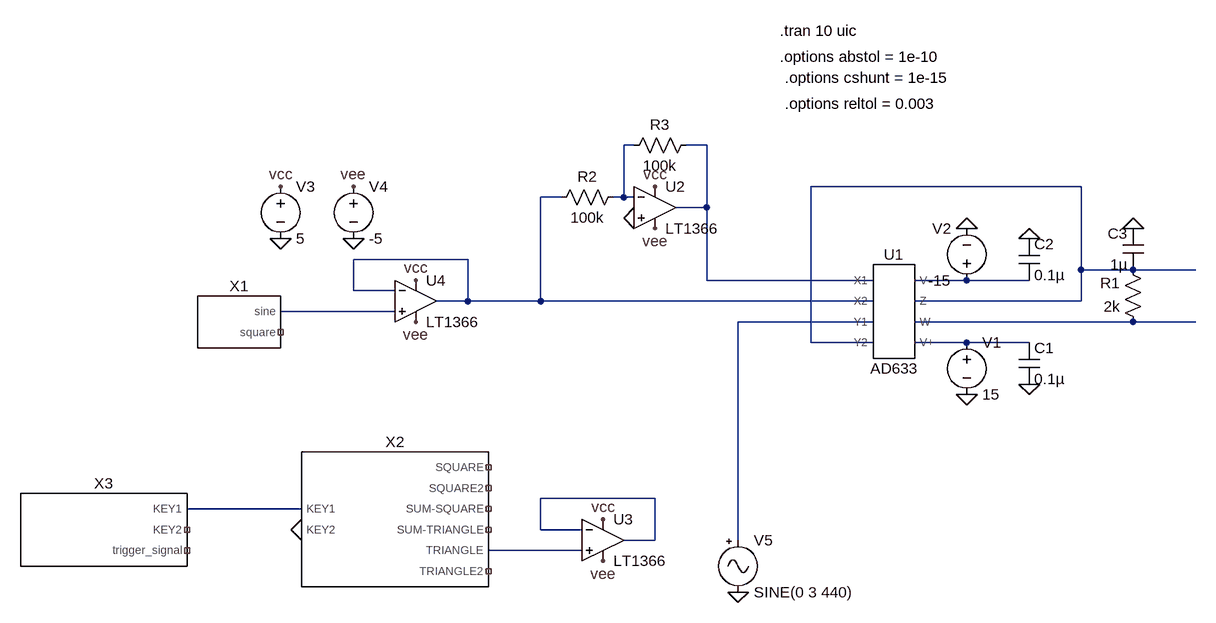
[diagram p0: schematic vcf_hopefully.asc]
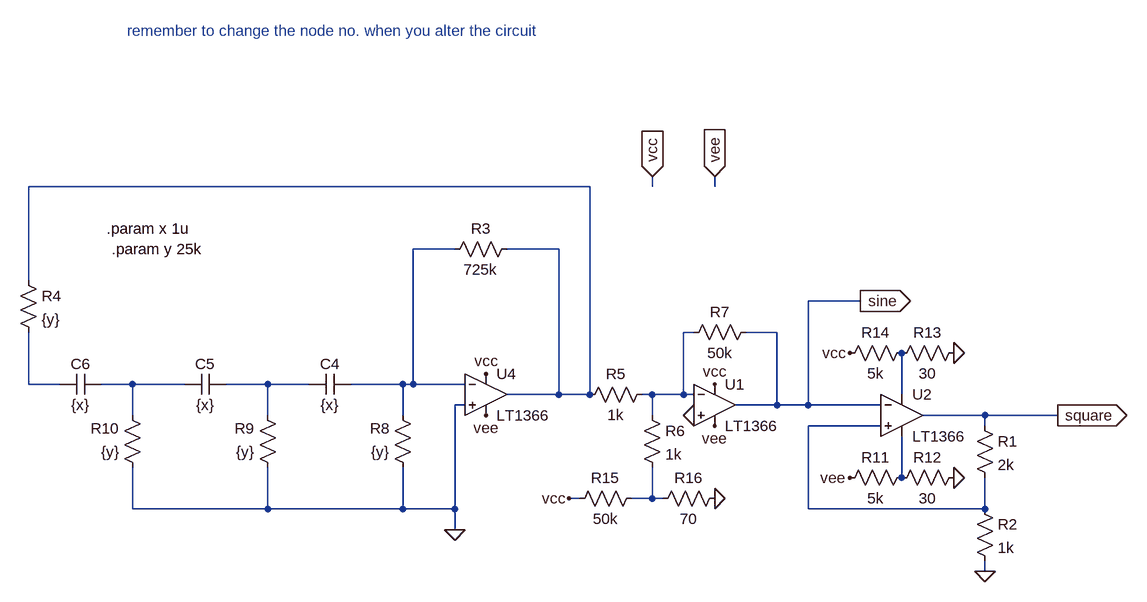
[diagram p1: sub-circuit lfo_new_square.asc]
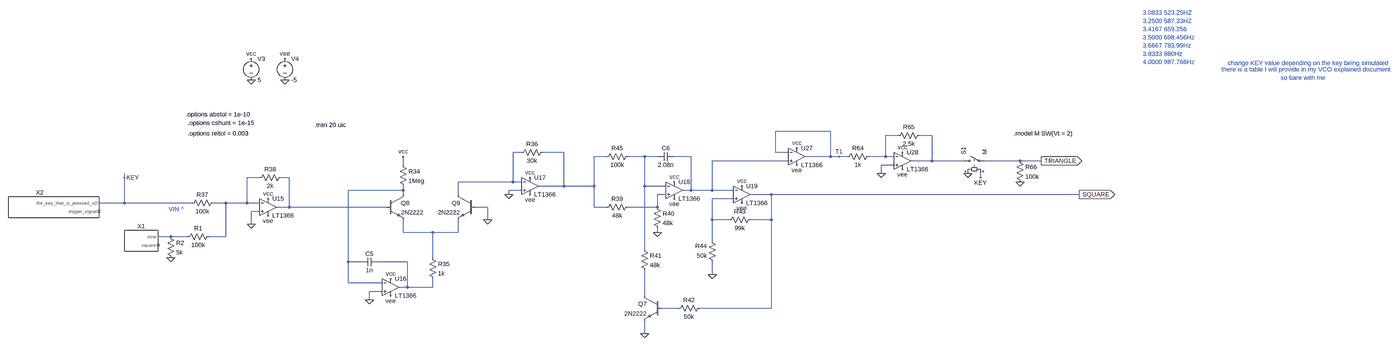
[diagram p2: sub-circuit vco_2keys.asc, whole sheet]
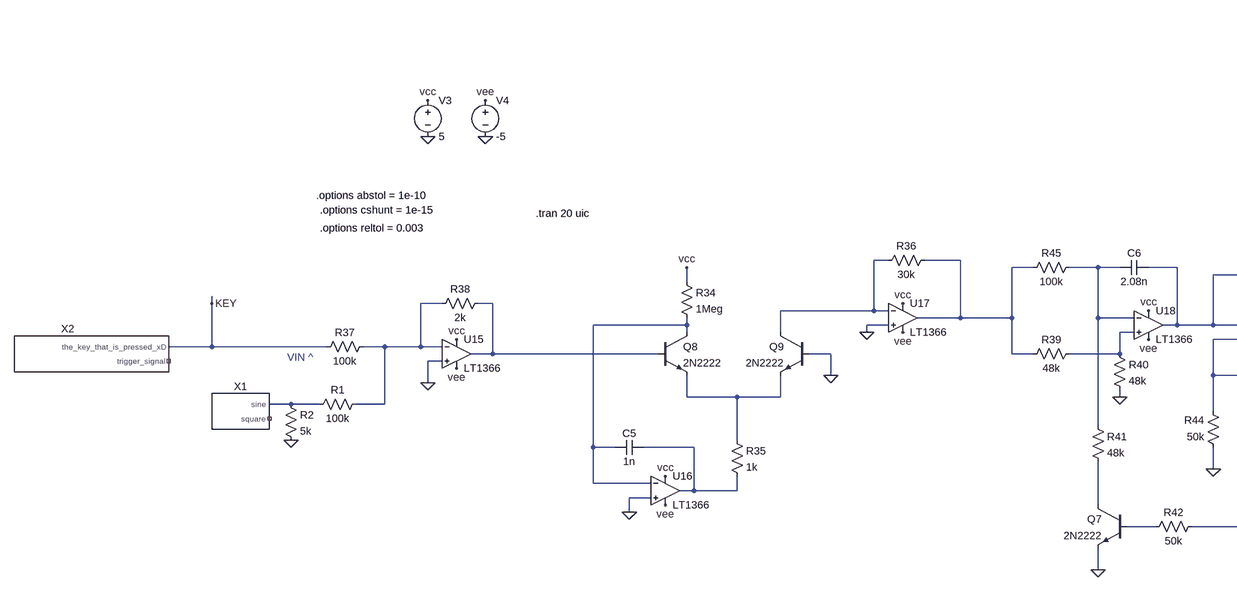
[diagram p3: sub-circuit vco_2keys.asc, part, row 1 of 1, column 1 of 2]
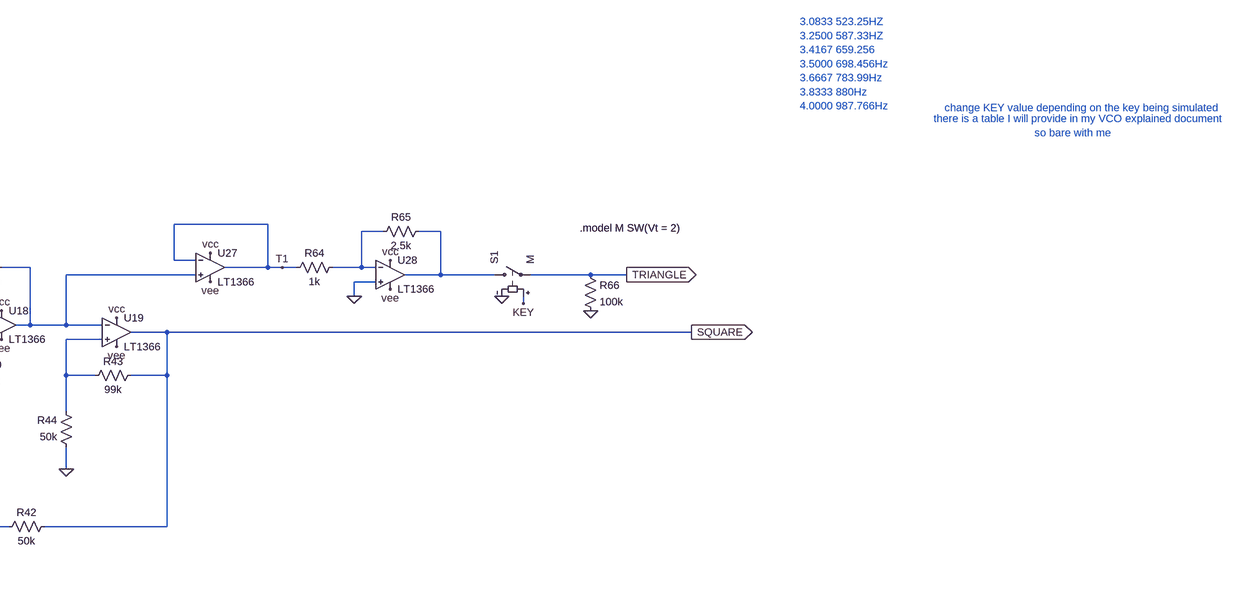
[diagram p4: sub-circuit vco_2keys.asc, part, row 1 of 1, column 2 of 2]
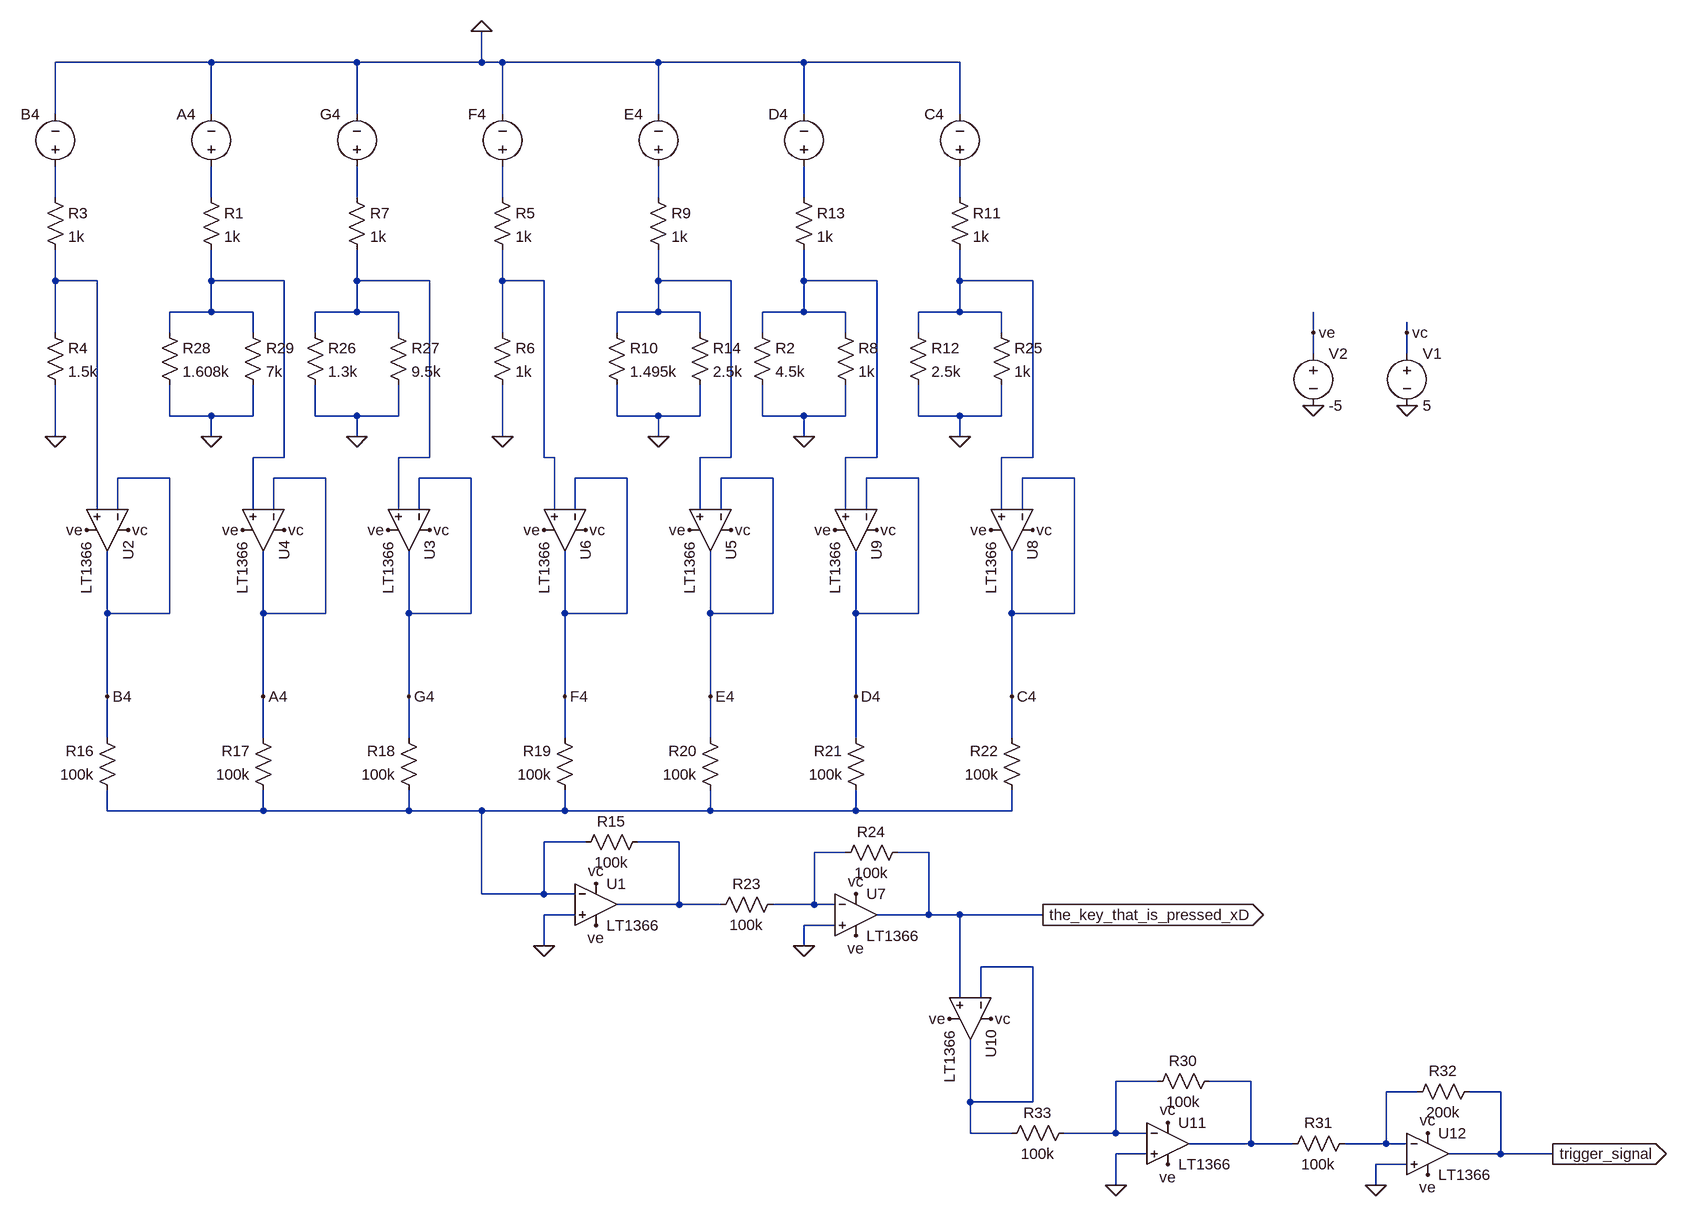
[diagram p5: sub-circuit key_input_with_trigger.asc]
vcf_hopefully.asc, the LTspice schematic file:
Version 4
SHEET 1 880 796
WIRE -112 80 -128 80
WIRE 0 80 -32 80
WIRE 576 144 160 144
WIRE -224 160 -256 160
WIRE -128 160 -128 80
WIRE -128 160 -144 160
WIRE -112 160 -128 160
WIRE 0 176 0 80
WIRE 0 176 -48 176
WIRE -368 256 -544 256
WIRE 576 272 576 144
WIRE 656 272 576 272
WIRE 752 272 656 272
WIRE 0 288 0 176
WIRE 256 288 0 288
WIRE 400 288 320 288
WIRE 496 288 400 288
WIRE -544 304 -544 256
WIRE -480 304 -544 304
WIRE -368 320 -368 256
WIRE -368 320 -416 320
WIRE -256 320 -256 160
WIRE -256 320 -368 320
WIRE 256 320 -256 320
WIRE 576 320 576 272
WIRE 576 320 320 320
WIRE -480 336 -656 336
WIRE 256 352 48 352
WIRE 656 352 320 352
WIRE 752 352 656 352
WIRE 160 384 160 144
WIRE 256 384 160 384
WIRE 400 384 320 384
WIRE 496 384 400 384
WIRE -80 624 -256 624
WIRE -624 640 -800 640
WIRE -256 672 -256 624
WIRE -192 672 -256 672
WIRE -80 688 -80 624
WIRE -80 688 -128 688
WIRE 48 688 48 352
WIRE -192 704 -336 704
FLAG 400 208 0
FLAG 400 464 0
FLAG 496 224 0
FLAG 496 448 0
FLAG 656 208 0
FLAG -544 224 0
FLAG -656 224 0
FLAG -656 144 vcc
FLAG -544 144 vee
FLAG -80 144 vcc
FLAG -80 208 vee
FLAG -112 192 0
FLAG -160 656 vcc
FLAG -160 720 vee
FLAG -448 288 vcc
FLAG -448 352 vee
FLAG -624 672 0
FLAG 48 768 0
SYMBOL AutoGenerated/AD633 288 336 R0
SYMATTR InstName U1
SYMBOL voltage 400 368 R0
SYMATTR InstName V1
SYMATTR Value 15
SYMBOL voltage 400 304 R180
WINDOW 0 24 96 Left 2
WINDOW 3 24 16 Left 2
SYMATTR InstName V2
SYMATTR Value -15
SYMBOL cap 480 384 R0
SYMATTR InstName C1
SYMATTR Value 0.1µ
SYMBOL cap 480 224 R0
SYMATTR InstName C2
SYMATTR Value 0.1µ
SYMBOL res 672 368 R180
WINDOW 0 36 76 Left 2
WINDOW 3 36 40 Left 2
SYMATTR InstName R1
SYMATTR Value 2k
SYMBOL cap 672 272 R180
WINDOW 0 24 56 Left 2
WINDOW 3 24 8 Left 2
SYMATTR InstName C3
SYMATTR Value 1µ
SYMBOL lfo_new_square -720 352 R0
SYMATTR InstName X1
SYMBOL Key_Input_2VCOSFINAL -928 672 R0
SYMATTR InstName X3
SYMBOL Opamps/LT1366 -80 112 R0
SYMATTR InstName U2
SYMBOL voltage -656 128 R0
SYMATTR InstName V3
SYMATTR Value 5
SYMBOL voltage -544 128 R0
SYMATTR InstName V4
SYMATTR Value -5
SYMBOL res -128 144 R90
WINDOW 0 0 56 VBottom 2
WINDOW 3 32 56 VTop 2
SYMATTR InstName R2
SYMATTR Value 100k
SYMBOL res -16 64 R90
WINDOW 0 0 56 VBottom 2
WINDOW 3 32 56 VTop 2
SYMATTR InstName R3
SYMATTR Value 100k
SYMBOL Opamps/LT1366 -160 624 R0
SYMATTR InstName U3
SYMBOL vco_2keys -480 656 R0
SYMATTR InstName X2
SYMBOL Opamps/LT1366 -448 256 R0
SYMATTR InstName U4
SYMBOL Misc/signal 48 672 R0
SYMATTR InstName V5
SYMATTR Value SINE(0 3 440)
TEXT 112 -96 Left 2 !.tran 10 uic
TEXT 112 -56 Left 2 !.options abstol = 1e-10
TEXT 120 -24 Left 2 !.options cshunt = 1e-15
TEXT 120 16 Left 2 !.options reltol = 0.003

lfo_new_square.asc, the sub-circuit schematic file:
Version 4
SHEET 1 1144 880
WIRE -576 -144 -1440 -144
WIRE -480 -144 -480 -160
WIRE -384 -144 -384 -160
WIRE -784 -48 -848 -48
WIRE -624 -48 -704 -48
WIRE -1440 0 -1440 -144
WIRE -160 32 -240 32
WIRE -416 80 -432 80
WIRE -288 80 -336 80
WIRE -1440 160 -1440 80
WIRE -1392 160 -1440 160
WIRE -1280 160 -1328 160
WIRE -1200 160 -1280 160
WIRE -1072 160 -1136 160
WIRE -1008 160 -1072 160
WIRE -864 160 -944 160
WIRE -848 160 -848 -48
WIRE -848 160 -864 160
WIRE -768 160 -848 160
WIRE -624 176 -624 -48
WIRE -624 176 -704 176
WIRE -576 176 -576 -144
WIRE -576 176 -624 176
WIRE -480 176 -496 176
WIRE -432 176 -432 80
WIRE -432 176 -480 176
WIRE -416 176 -432 176
WIRE -96 176 -96 112
WIRE -768 192 -784 192
WIRE -288 192 -288 80
WIRE -288 192 -352 192
WIRE -240 192 -240 32
WIRE -240 192 -288 192
WIRE -128 192 -240 192
WIRE -1280 208 -1280 160
WIRE -1072 208 -1072 160
WIRE -864 208 -864 160
WIRE -480 208 -480 176
WIRE 32 208 -64 208
WIRE 144 208 32 208
WIRE -128 224 -240 224
WIRE 32 224 32 208
WIRE -96 304 -96 240
WIRE -592 336 -608 336
WIRE -480 336 -480 288
WIRE -480 336 -512 336
WIRE -464 336 -480 336
WIRE -1280 352 -1280 288
WIRE -1072 352 -1072 288
WIRE -1072 352 -1280 352
WIRE -864 352 -864 288
WIRE -864 352 -1072 352
WIRE -784 352 -784 192
WIRE -784 352 -864 352
WIRE -240 352 -240 224
WIRE 32 352 32 304
WIRE 32 352 -240 352
WIRE -784 384 -784 352
WIRE 32 448 32 432
FLAG 32 448 0
FLAG -784 384 0
FLAG -480 -160 vcc
IOPIN -480 -160 In
FLAG -384 -160 vee
IOPIN -384 -160 In
FLAG -736 144 vcc
FLAG -736 208 vee
FLAG 144 208 square
IOPIN 144 208 Out
FLAG -160 32 sine
IOPIN -160 32 Out
FLAG -416 208 0
FLAG -384 160 vcc
FLAG -384 224 vee
FLAG -16 112 0
FLAG -16 304 0
FLAG -176 112 vcc
FLAG -176 304 vee
FLAG -384 336 0
FLAG -608 336 vcc
SYMBOL res 16 208 R0
SYMATTR InstName R1
SYMATTR Value 2k
SYMBOL res 16 336 R0
SYMATTR InstName R2
SYMATTR Value 1k
SYMBOL cap -944 144 R90
WINDOW 0 0 32 VBottom 2
WINDOW 3 32 32 VTop 2
SYMATTR InstName C4
SYMATTR Value {x}
SYMBOL cap -1136 144 R90
WINDOW 0 0 32 VBottom 2
WINDOW 3 32 32 VTop 2
SYMATTR InstName C5
SYMATTR Value {x}
SYMBOL cap -1328 144 R90
WINDOW 0 0 32 VBottom 2
WINDOW 3 32 32 VTop 2
SYMATTR InstName C6
SYMATTR Value {x}
SYMBOL res -848 304 R180
WINDOW 0 36 76 Left 2
WINDOW 3 36 40 Left 2
SYMATTR InstName R8
SYMATTR Value {y}
SYMBOL res -1056 304 R180
WINDOW 0 36 76 Left 2
WINDOW 3 36 40 Left 2
SYMATTR InstName R9
SYMATTR Value {y}
SYMBOL res -1264 304 R180
WINDOW 0 36 76 Left 2
WINDOW 3 36 40 Left 2
SYMATTR InstName R10
SYMATTR Value {y}
SYMBOL Opamps/LT1366 -736 112 R0
SYMATTR InstName U4
SYMBOL Opamps/LT1366 -96 144 R0
SYMATTR InstName U2
SYMBOL res -688 -64 R90
WINDOW 0 0 56 VBottom 2
WINDOW 3 32 56 VTop 2
SYMATTR InstName R3
SYMATTR Value 725k
SYMBOL Opamps/LT1366 -384 128 R0
SYMATTR InstName U1
SYMBOL res -480 160 R90
WINDOW 0 0 56 VBottom 2
WINDOW 3 32 56 VTop 2
SYMATTR InstName R5
SYMATTR Value 1k
SYMBOL res -496 192 R0
SYMATTR InstName R6
SYMATTR Value 1k
SYMBOL res -320 64 R90
WINDOW 0 0 56 VBottom 2
WINDOW 3 32 56 VTop 2
SYMATTR InstName R7
SYMATTR Value 50k
SYMBOL res -80 288 R90
WINDOW 0 0 56 VBottom 2
WINDOW 3 32 56 VTop 2
SYMATTR InstName R11
SYMATTR Value 5k
SYMBOL res 0 288 R90
WINDOW 0 0 56 VBottom 2
WINDOW 3 32 56 VTop 2
SYMATTR InstName R12
SYMATTR Value 30
SYMBOL res 0 96 R90
WINDOW 0 0 56 VBottom 2
WINDOW 3 32 56 VTop 2
SYMATTR InstName R13
SYMATTR Value 30
SYMBOL res -80 96 R90
WINDOW 0 0 56 VBottom 2
WINDOW 3 32 56 VTop 2
SYMATTR InstName R14
SYMATTR Value 5k
SYMBOL res -1456 -16 R0
SYMATTR InstName R4
SYMATTR Value {y}
SYMBOL res -608 352 R270
WINDOW 0 32 56 VTop 2
WINDOW 3 0 56 VBottom 2
SYMATTR InstName R15
SYMATTR Value 50k
SYMBOL res -480 352 R270
WINDOW 0 32 56 VTop 2
WINDOW 3 0 56 VBottom 2
SYMATTR InstName R16
SYMATTR Value 70
TEXT -1320 -80 Left 2 !.param x 1u
TEXT -1312 -48 Left 2 !.param y 25k
TEXT -1288 -384 Left 2 ;remember to change the node no. when you alter the circuit

vco_2keys.asc, the sub-circuit schematic file:
Version 4
SHEET 1 3312 3404
WIRE 512 1840 304 1840
WIRE 768 1856 720 1856
WIRE 896 1856 848 1856
WIRE -800 1920 -832 1920
WIRE -640 1920 -720 1920
WIRE 304 1920 304 1840
WIRE 352 1920 304 1920
WIRE -336 1936 -384 1936
WIRE -192 1936 -256 1936
WIRE -144 1936 -192 1936
WIRE -16 1936 -80 1936
WIRE 512 1936 512 1840
WIRE 512 1936 416 1936
WIRE 544 1936 512 1936
WIRE 576 1936 544 1936
WIRE 720 1936 720 1856
WIRE 720 1936 656 1936
WIRE 752 1936 720 1936
WIRE 352 1952 64 1952
WIRE 896 1952 896 1856
WIRE 896 1952 816 1952
WIRE 1056 1952 896 1952
WIRE 1296 1952 1136 1952
WIRE 1376 1952 1296 1952
WIRE -1248 1968 -1248 1936
WIRE 752 1968 704 1968
WIRE 704 2000 704 1968
WIRE -2304 2016 -2304 2000
WIRE -1792 2016 -1840 2016
WIRE -1680 2016 -1712 2016
WIRE 1120 2016 1120 2000
WIRE -832 2032 -832 1920
WIRE -832 2032 -1040 2032
WIRE -800 2032 -832 2032
WIRE -640 2048 -640 1920
WIRE -640 2048 -736 2048
WIRE -384 2048 -384 1936
WIRE -384 2048 -640 2048
WIRE -192 2048 -192 1936
WIRE -112 2048 -192 2048
WIRE -1248 2064 -1248 2048
WIRE -1248 2064 -1456 2064
WIRE -800 2064 -848 2064
WIRE -16 2064 -16 1936
WIRE -16 2064 -48 2064
WIRE 64 2064 64 1952
WIRE 64 2064 -16 2064
WIRE 144 2064 64 2064
WIRE -1248 2080 -1248 2064
WIRE -1040 2080 -1040 2032
WIRE -848 2080 -848 2064
WIRE -112 2080 -144 2080
WIRE 288 2080 208 2080
WIRE 1520 2080 288 2080
WIRE 144 2096 64 2096
WIRE -2304 2112 -2304 2016
WIRE -2304 2112 -2400 2112
WIRE -2048 2112 -2304 2112
WIRE -1920 2112 -1968 2112
WIRE -1840 2112 -1840 2016
WIRE -1840 2112 -1920 2112
WIRE -1792 2112 -1840 2112
WIRE -1680 2128 -1680 2016
WIRE -1680 2128 -1728 2128
WIRE -1312 2128 -1680 2128
WIRE -928 2128 -976 2128
WIRE -384 2128 -384 2048
WIRE -336 2128 -384 2128
WIRE -144 2128 -144 2080
WIRE -144 2128 -256 2128
WIRE -1792 2144 -1824 2144
WIRE -928 2176 -928 2128
WIRE 64 2176 64 2096
WIRE 128 2176 64 2176
WIRE 288 2176 288 2080
WIRE 288 2176 208 2176
WIRE -1824 2192 -1824 2144
WIRE -1248 2224 -1248 2176
WIRE -1136 2224 -1248 2224
WIRE -1040 2224 -1040 2176
WIRE -1040 2224 -1136 2224
WIRE -144 2224 -144 2208
WIRE -2128 2240 -2176 2240
WIRE -2064 2240 -2128 2240
WIRE -1920 2240 -1920 2112
WIRE -1920 2240 -1984 2240
WIRE 64 2256 64 2176
WIRE -192 2288 -192 2048
WIRE -1136 2320 -1136 2224
WIRE -1456 2336 -1456 2064
WIRE -1408 2336 -1456 2336
WIRE -1232 2336 -1344 2336
WIRE 64 2384 64 2336
WIRE -1456 2416 -1456 2336
WIRE -1328 2416 -1456 2416
WIRE -1232 2432 -1232 2336
WIRE -1232 2432 -1264 2432
WIRE -1136 2432 -1136 2400
WIRE -1136 2432 -1232 2432
WIRE -1328 2448 -1376 2448
WIRE -192 2464 -192 2368
WIRE -1376 2480 -1376 2448
WIRE -64 2512 -128 2512
WIRE 288 2512 288 2176
WIRE 288 2512 16 2512
WIRE -192 2608 -192 2560
FLAG -928 2176 0
FLAG -1248 1936 vcc
FLAG -1376 2480 0
FLAG -848 2080 0
FLAG -768 2016 vcc
FLAG -768 2080 vee
FLAG -1296 2400 vcc
FLAG -1296 2464 vee
FLAG -1760 2096 vcc
FLAG -1824 2192 0
FLAG -80 2032 vcc
FLAG 176 2048 vcc
FLAG 1376 1952 TRIANGLE
IOPIN 1376 1952 Out
FLAG -144 2224 0
FLAG -192 2608 0
FLAG 64 2384 0
FLAG 176 2112 vee
FLAG -80 2096 vee
FLAG -1760 2160 vee
FLAG 1520 2080 SQUARE
IOPIN 1520 2080 Out
FLAG 384 1904 vcc
FLAG 384 1968 vee
FLAG 704 2000 0
FLAG 784 1920 vcc
FLAG 784 1984 vee
FLAG 1296 2032 0
FLAG 544 1936 T1
FLAG -1696 1568 0
FLAG -1824 1568 0
FLAG -1824 1488 vcc
FLAG -1696 1488 vee
FLAG 1072 2000 0
FLAG -2304 2016 KEY
FLAG 1120 2016 KEY
FLAG -2128 2320 0
SYMBOL res -1264 1952 R0
SYMATTR InstName R34
SYMATTR Value 1Meg
SYMBOL cap -1344 2320 R90
WINDOW 0 0 32 VBottom 2
WINDOW 3 32 32 VTop 2
SYMATTR InstName C5
SYMATTR Value 1n
SYMBOL res -1152 2304 R0
SYMATTR InstName R35
SYMATTR Value 1k
SYMBOL res -704 1904 R90
WINDOW 0 0 56 VBottom 2
WINDOW 3 32 56 VTop 2
SYMATTR InstName R36
SYMATTR Value 30k
SYMBOL res -1952 2096 R90
WINDOW 0 0 56 VBottom 2
WINDOW 3 32 56 VTop 2
SYMATTR InstName R37
SYMATTR Value 100k
SYMBOL res -1696 2000 R90
WINDOW 0 0 56 VBottom 2
WINDOW 3 32 56 VTop 2
SYMATTR InstName R38
SYMATTR Value 2k
SYMBOL cap -80 1920 R90
WINDOW 0 0 32 VBottom 2
WINDOW 3 32 32 VTop 2
SYMATTR InstName C6
SYMATTR Value 2.08n
SYMBOL res -240 2112 R90
WINDOW 0 0 56 VBottom 2
WINDOW 3 32 56 VTop 2
SYMATTR InstName R39
SYMATTR Value 48k
SYMBOL res -160 2112 R0
SYMATTR InstName R40
SYMATTR Value 48k
SYMBOL res -208 2272 R0
SYMATTR InstName R41
SYMATTR Value 48k
SYMBOL npn -128 2464 M0
SYMATTR InstName Q7
SYMATTR Value 2N2222
SYMBOL res 32 2496 R90
WINDOW 0 0 56 VBottom 2
WINDOW 3 32 56 VTop 2
SYMATTR InstName R42
SYMATTR Value 50k
SYMBOL res 224 2160 R90
WINDOW 0 0 56 VBottom 2
WINDOW 3 32 56 VTop 2
SYMATTR InstName R43
SYMATTR Value 99k
SYMBOL res 80 2352 R180
WINDOW 0 36 76 Left 2
WINDOW 3 36 40 Left 2
SYMATTR InstName R44
SYMATTR Value 50k
SYMBOL res -240 1920 R90
WINDOW 0 0 56 VBottom 2
WINDOW 3 32 56 VTop 2
SYMATTR InstName R45
SYMATTR Value 100k
SYMBOL npn -1312 2080 R0
SYMATTR InstName Q8
SYMATTR Value 2N2222
SYMBOL npn -976 2080 M0
SYMATTR InstName Q9
SYMATTR Value 2N2222
SYMBOL LT1366 -1760 2064 R0
SYMATTR InstName U15
SYMBOL LT1366 -1296 2368 R0
SYMATTR InstName U16
SYMBOL LT1366 -768 1984 R0
SYMATTR InstName U17
SYMBOL LT1366 -80 2000 R0
SYMATTR InstName U18
SYMBOL LT1366 176 2016 R0
SYMATTR InstName U19
SYMBOL LT1366 384 1872 R0
SYMATTR InstName U27
SYMBOL LT1366 784 1888 R0
SYMATTR InstName U28
SYMBOL res 672 1920 R90
WINDOW 0 0 56 VBottom 2
WINDOW 3 32 56 VTop 2
SYMATTR InstName R64
SYMATTR Value 1k
SYMBOL res 864 1840 R90
WINDOW 0 0 56 VBottom 2
WINDOW 3 32 56 VTop 2
SYMATTR InstName R65
SYMATTR Value 2.5k
SYMBOL res 1280 1936 R0
SYMATTR InstName R66
SYMATTR Value 100k
SYMBOL voltage -1824 1472 R0
SYMATTR InstName V3
SYMATTR Value 5
SYMBOL voltage -1696 1472 R0
SYMATTR InstName V4
SYMATTR Value -5
SYMBOL lfo_new_square -2240 2256 R0
SYMATTR InstName X1
SYMBOL Key_Input_with_trigger -2624 2128 R0
SYMATTR InstName X2
SYMBOL res -1968 2224 R90
WINDOW 0 0 56 VBottom 2
WINDOW 3 32 56 VTop 2
SYMATTR InstName R1
SYMATTR Value 100k
SYMBOL sw 1040 1952 R270
SYMATTR InstName S1
SYMATTR Value M
SYMBOL res -2144 2224 R0
SYMATTR InstName R2
SYMATTR Value 5k
TEXT -2136 2136 Left 2 ;VIN ^
TEXT 2696 1504 Left 2 ;change KEY value depending on the key being simulated
TEXT 2672 1528 Left 2 ;there is a table I will provide in my VCO explained document
TEXT 2896 1560 Left 2 ;so bare with me
TEXT 2328 1312 Left 2 ;3.0833 523.25HZ
TEXT 2328 1344 Left 2 ;3.2500 587.33HZ\n3.4167 659.256\n3.5000 698.456Hz\n3.6667 783.99Hz\n3.8333 880Hz\n4.0000 987.766Hz
TEXT 1272 1848 Left 2 !.model M SW(Vt = 2)
TEXT -1584 1816 Left 2 !.tran 20 uic
TEXT -2072 1776 Left 2 !.options abstol = 1e-10
TEXT -2064 1808 Left 2 !.options cshunt = 1e-15
TEXT -2064 1848 Left 2 !.options reltol = 0.003

key_input_with_trigger.asc, the sub-circuit schematic file:
Version 4
SHEET 1 1488 1832
WIRE -800 48 -1040 48
WIRE -576 48 -800 48
WIRE -384 48 -384 0
WIRE -384 48 -576 48
WIRE -352 48 -384 48
WIRE -112 48 -352 48
WIRE 112 48 -112 48
WIRE 352 48 112 48
WIRE -1040 128 -1040 48
WIRE -800 128 -800 48
WIRE -576 128 -576 48
WIRE -352 128 -352 48
WIRE -112 128 -112 48
WIRE 112 128 112 48
WIRE 352 128 352 48
WIRE -1040 256 -1040 208
WIRE -800 256 -800 208
WIRE -576 256 -576 208
WIRE -352 256 -352 208
WIRE -112 256 -112 208
WIRE 112 256 112 208
WIRE 352 256 352 208
WIRE -1040 384 -1040 336
WIRE -976 384 -1040 384
WIRE -800 384 -800 336
WIRE -688 384 -800 384
WIRE -576 384 -576 336
WIRE -464 384 -576 384
WIRE -352 384 -352 336
WIRE -288 384 -352 384
WIRE -112 384 -112 336
WIRE 0 384 -112 384
WIRE 112 384 112 336
WIRE 224 384 112 384
WIRE 352 384 352 336
WIRE 464 384 352 384
WIRE -800 432 -800 384
WIRE -800 432 -864 432
WIRE -736 432 -800 432
WIRE -576 432 -576 384
WIRE -576 432 -640 432
WIRE -512 432 -576 432
WIRE -112 432 -112 384
WIRE -112 432 -176 432
WIRE -48 432 -112 432
WIRE 112 432 112 384
WIRE 112 432 48 432
WIRE 176 432 112 432
WIRE 352 432 352 384
WIRE 352 432 288 432
WIRE 416 432 352 432
WIRE -1040 464 -1040 384
WIRE -864 464 -864 432
WIRE -736 464 -736 432
WIRE -640 464 -640 432
WIRE -512 464 -512 432
WIRE -352 464 -352 384
WIRE -176 464 -176 432
WIRE -48 464 -48 432
WIRE 48 464 48 432
WIRE 176 464 176 432
WIRE 288 464 288 432
WIRE 416 464 416 432
WIRE 896 464 896 432
WIRE 1040 464 1040 448
WIRE 896 496 896 464
WIRE 1040 496 1040 464
WIRE -864 592 -864 544
WIRE -800 592 -864 592
WIRE -736 592 -736 544
WIRE -736 592 -800 592
WIRE -640 592 -640 544
WIRE -576 592 -640 592
WIRE -512 592 -512 544
WIRE -512 592 -576 592
WIRE -176 592 -176 544
WIRE -112 592 -176 592
WIRE -48 592 -48 544
WIRE -48 592 -112 592
WIRE 48 592 48 544
WIRE 112 592 48 592
WIRE 176 592 176 544
WIRE 176 592 112 592
WIRE 288 592 288 544
WIRE 352 592 288 592
WIRE 416 592 416 544
WIRE 416 592 352 592
WIRE -1040 624 -1040 544
WIRE -800 624 -800 592
WIRE -576 624 -576 592
WIRE -352 624 -352 544
WIRE -112 624 -112 592
WIRE 112 624 112 592
WIRE 352 624 352 592
WIRE -688 656 -688 384
WIRE -688 656 -736 656
WIRE -464 656 -464 384
WIRE -464 656 -512 656
WIRE -288 656 -288 384
WIRE -272 656 -288 656
WIRE 0 656 0 384
WIRE 0 656 -48 656
WIRE 224 656 224 384
WIRE 224 656 176 656
WIRE 464 656 464 384
WIRE 464 656 416 656
WIRE -864 688 -944 688
WIRE -624 688 -704 688
WIRE -400 688 -480 688
WIRE -160 688 -240 688
WIRE 64 688 -16 688
WIRE 288 688 208 688
WIRE 528 688 448 688
WIRE -976 736 -976 384
WIRE -944 736 -944 688
WIRE -736 736 -736 656
WIRE -704 736 -704 688
WIRE -512 736 -512 656
WIRE -480 736 -480 688
WIRE -272 736 -272 656
WIRE -240 736 -240 688
WIRE -48 736 -48 656
WIRE -16 736 -16 688
WIRE 176 736 176 656
WIRE 208 736 208 688
WIRE 416 736 416 656
WIRE 448 736 448 688
WIRE -960 896 -960 800
WIRE -864 896 -864 688
WIRE -864 896 -960 896
WIRE -720 896 -720 800
WIRE -624 896 -624 688
WIRE -624 896 -720 896
WIRE -496 896 -496 800
WIRE -400 896 -400 688
WIRE -400 896 -496 896
WIRE -256 896 -256 800
WIRE -160 896 -160 688
WIRE -160 896 -256 896
WIRE -32 896 -32 800
WIRE 64 896 64 688
WIRE 64 896 -32 896
WIRE 192 896 192 800
WIRE 288 896 288 688
WIRE 288 896 192 896
WIRE 432 896 432 800
WIRE 528 896 528 688
WIRE 528 896 432 896
WIRE -960 1024 -960 896
WIRE -720 1024 -720 896
WIRE -496 1024 -496 896
WIRE -256 1024 -256 896
WIRE -32 1024 -32 896
WIRE 192 1024 192 896
WIRE 432 1024 432 896
WIRE -960 1088 -960 1024
WIRE -720 1088 -720 1024
WIRE -496 1088 -496 1024
WIRE -256 1088 -256 1024
WIRE -32 1088 -32 1024
WIRE 192 1088 192 1024
WIRE 432 1088 432 1024
WIRE -960 1200 -960 1168
WIRE -720 1200 -720 1168
WIRE -720 1200 -960 1200
WIRE -496 1200 -496 1168
WIRE -496 1200 -720 1200
WIRE -384 1200 -496 1200
WIRE -256 1200 -256 1168
WIRE -256 1200 -384 1200
WIRE -32 1200 -32 1168
WIRE -32 1200 -256 1200
WIRE 192 1200 192 1168
WIRE 192 1200 -32 1200
WIRE 432 1200 432 1168
WIRE 432 1200 192 1200
WIRE -224 1248 -288 1248
WIRE -80 1248 -144 1248
WIRE 176 1264 128 1264
WIRE 304 1264 256 1264
WIRE -384 1328 -384 1200
WIRE -288 1328 -288 1248
WIRE -288 1328 -384 1328
WIRE -240 1328 -288 1328
WIRE -80 1344 -80 1248
WIRE -80 1344 -176 1344
WIRE -16 1344 -80 1344
WIRE 128 1344 128 1264
WIRE 128 1344 64 1344
WIRE 160 1344 128 1344
WIRE -240 1360 -288 1360
WIRE 304 1360 304 1264
WIRE 304 1360 224 1360
WIRE 352 1360 304 1360
WIRE 480 1360 352 1360
WIRE 160 1376 112 1376
WIRE -288 1408 -288 1360
WIRE 112 1408 112 1376
WIRE 464 1440 384 1440
WIRE 352 1488 352 1360
WIRE 384 1488 384 1440
WIRE 656 1616 592 1616
WIRE 800 1616 736 1616
WIRE 1056 1632 1008 1632
WIRE 1184 1632 1136 1632
WIRE 368 1648 368 1552
WIRE 464 1648 464 1440
WIRE 464 1648 368 1648
WIRE 368 1696 368 1648
WIRE 432 1696 368 1696
WIRE 592 1696 592 1616
WIRE 592 1696 512 1696
WIRE 640 1696 592 1696
WIRE 800 1712 800 1616
WIRE 800 1712 704 1712
WIRE 864 1712 800 1712
WIRE 1008 1712 1008 1632
WIRE 1008 1712 944 1712
WIRE 1040 1712 1008 1712
WIRE 640 1728 592 1728
WIRE 1184 1728 1184 1632
WIRE 1184 1728 1104 1728
WIRE 1264 1728 1184 1728
WIRE 1040 1744 992 1744
WIRE 592 1776 592 1728
WIRE 992 1776 992 1744
FLAG -384 0 0
FLAG 432 1024 C4
FLAG 192 1024 D4
FLAG -32 1024 E4
FLAG -256 1024 F4
FLAG -496 1024 G4
FLAG -720 1024 A4
FLAG -960 1024 B4
FLAG -288 1408 0
FLAG 1040 576 0
FLAG 1040 464 vc
FLAG 896 576 0
FLAG 896 464 ve
FLAG 464 768 vc
FLAG 224 768 vc
FLAG 0 768 vc
FLAG -224 768 vc
FLAG -464 768 vc
FLAG -688 768 vc
FLAG -928 768 vc
FLAG -208 1312 vc
FLAG 400 768 ve
FLAG 160 768 ve
FLAG -64 768 ve
FLAG -288 768 ve
FLAG -528 768 ve
FLAG -752 768 ve
FLAG -992 768 ve
FLAG -208 1376 ve
FLAG 112 1408 0
FLAG 192 1328 vc
FLAG 192 1392 ve
FLAG 480 1360 the_key_that_is_pressed_xD
IOPIN 480 1360 Out
FLAG 352 624 0
FLAG 112 624 0
FLAG -112 624 0
FLAG -576 624 0
FLAG -800 624 0
FLAG -1040 624 0
FLAG -352 624 0
FLAG 1264 1728 trigger_signal
IOPIN 1264 1728 Out
FLAG 400 1520 vc
FLAG 336 1520 ve
FLAG 592 1776 0
FLAG 672 1680 vc
FLAG 672 1744 ve
FLAG 992 1776 0
FLAG 1072 1696 vc
FLAG 1072 1760 ve
SYMBOL res -816 240 R0
SYMATTR InstName R1
SYMATTR Value 1k
SYMBOL res -1056 240 R0
SYMATTR InstName R3
SYMATTR Value 1k
SYMBOL res -1056 448 R0
SYMATTR InstName R4
SYMATTR Value 1.5k
SYMBOL res -368 240 R0
SYMATTR InstName R5
SYMATTR Value 1k
SYMBOL res -368 448 R0
SYMATTR InstName R6
SYMATTR Value 1k
SYMBOL res -592 240 R0
SYMATTR InstName R7
SYMATTR Value 1k
SYMBOL res -128 240 R0
SYMATTR InstName R9
SYMATTR Value 1k
SYMBOL res 336 240 R0
SYMATTR InstName R11
SYMATTR Value 1k
SYMBOL res 96 240 R0
SYMATTR InstName R13
SYMATTR Value 1k
SYMBOL voltage -1040 224 R180
WINDOW 0 24 96 Left 2
WINDOW 3 24 16 Invisible 2
WINDOW 123 0 0 Left 0
WINDOW 39 0 0 Left 0
SYMATTR InstName B4
SYMATTR Value PWL(30.499999999999 0 30.5 5 35 5 35.000000000001 0)
SYMBOL voltage -800 224 R180
WINDOW 0 24 96 Left 2
WINDOW 3 24 16 Invisible 2
WINDOW 123 0 0 Left 0
WINDOW 39 0 0 Left 0
SYMATTR InstName A4
SYMATTR Value PWL(25.499999999999 0 25.5 5 30 5 30.000000000001 0)
SYMBOL voltage -576 224 R180
WINDOW 0 24 96 Left 2
WINDOW 3 24 68 Invisible 2
WINDOW 123 0 0 Left 0
WINDOW 39 0 0 Left 0
SYMATTR InstName G4
SYMATTR Value PWL(20.499999999999 0 20.5 5 25 5 25.000000000001 0)
SYMBOL voltage -352 224 R180
WINDOW 0 24 96 Left 2
WINDOW 3 24 68 Invisible 2
WINDOW 123 0 0 Left 0
WINDOW 39 0 0 Left 0
SYMATTR InstName F4
SYMATTR Value PWL(15.499999999999 0 15.5 5 20 5 20.000000000001 0)
SYMBOL voltage -112 224 R180
WINDOW 0 24 96 Left 2
WINDOW 3 24 68 Invisible 2
WINDOW 123 0 0 Left 0
WINDOW 39 0 0 Left 0
SYMATTR InstName E4
SYMATTR Value PWL(10.499999999999 0 10.5 5 15 5 15.000000000001 0)
SYMBOL voltage 112 224 R180
WINDOW 0 24 96 Left 2
WINDOW 3 24 74 Invisible 2
WINDOW 123 0 0 Left 0
WINDOW 39 0 0 Left 0
SYMATTR InstName D4
SYMATTR Value PWL(5.499999999999 0 5.5 5 10 5 10.000000000001 0)
SYMBOL voltage 352 224 R180
WINDOW 0 24 96 Left 2
WINDOW 3 24 68 Invisible 2
WINDOW 123 0 0 Left 0
WINDOW 39 0 0 Left 0
SYMATTR InstName C4
SYMATTR Value PWL(0 0 0.049999999999 0 0.05 5 5 5 5.000000000001 0)
SYMBOL LT1366 -208 1280 R0
SYMATTR InstName U1
SYMBOL res -128 1232 R90
WINDOW 0 0 56 VBottom 2
WINDOW 3 32 56 VTop 2
SYMATTR InstName R15
SYMATTR Value 100k
SYMBOL res -944 1184 R180
WINDOW 0 36 76 Left 2
WINDOW 3 36 40 Left 2
SYMATTR InstName R16
SYMATTR Value 100k
SYMBOL res -704 1184 R180
WINDOW 0 36 76 Left 2
WINDOW 3 36 40 Left 2
SYMATTR InstName R17
SYMATTR Value 100k
SYMBOL res -480 1184 R180
WINDOW 0 36 76 Left 2
WINDOW 3 36 40 Left 2
SYMATTR InstName R18
SYMATTR Value 100k
SYMBOL res -240 1184 R180
WINDOW 0 36 76 Left 2
WINDOW 3 36 40 Left 2
SYMATTR InstName R19
SYMATTR Value 100k
SYMBOL res -16 1184 R180
WINDOW 0 36 76 Left 2
WINDOW 3 36 40 Left 2
SYMATTR InstName R20
SYMATTR Value 100k
SYMBOL res 208 1184 R180
WINDOW 0 36 76 Left 2
WINDOW 3 36 40 Left 2
SYMATTR InstName R21
SYMATTR Value 100k
SYMBOL res 448 1184 R180
WINDOW 0 36 76 Left 2
WINDOW 3 36 40 Left 2
SYMATTR InstName R22
SYMATTR Value 100k
SYMBOL LT1366 -432 768 R90
SYMATTR InstName U3
SYMBOL LT1366 -896 768 R90
SYMATTR InstName U2
SYMBOL LT1366 -656 768 R90
SYMATTR InstName U4
SYMBOL LT1366 32 768 R90
SYMATTR InstName U5
SYMBOL LT1366 -192 768 R90
SYMATTR InstName U6
SYMBOL LT1366 496 768 R90
SYMATTR InstName U8
SYMBOL LT1366 256 768 R90
SYMATTR InstName U9
SYMBOL voltage 1040 480 R0
SYMATTR InstName V1
SYMATTR Value 5
SYMBOL voltage 896 480 R0
SYMATTR InstName V2
SYMATTR Value -5
SYMBOL LT1366 192 1296 R0
SYMATTR InstName U7
SYMBOL res 80 1328 R90
WINDOW 0 0 56 VBottom 2
WINDOW 3 32 56 VTop 2
SYMATTR InstName R23
SYMATTR Value 100k
SYMBOL res 272 1248 R90
WINDOW 0 0 56 VBottom 2
WINDOW 3 32 56 VTop 2
SYMATTR InstName R24
SYMATTR Value 100k
SYMBOL res 272 448 R0
SYMATTR InstName R12
SYMATTR Value 2.5k
SYMBOL res 400 448 R0
SYMATTR InstName R25
SYMATTR Value 1k
SYMBOL res 32 448 R0
SYMATTR InstName R2
SYMATTR Value 4.5k
SYMBOL res 160 448 R0
SYMATTR InstName R8
SYMATTR Value 1k
SYMBOL res -192 448 R0
SYMATTR InstName R10
SYMATTR Value 1.495k
SYMBOL res -64 448 R0
SYMATTR InstName R14
SYMATTR Value 2.5k
SYMBOL res -656 448 R0
SYMATTR InstName R26
SYMATTR Value 1.3k
SYMBOL res -528 448 R0
SYMATTR InstName R27
SYMATTR Value 9.5k
SYMBOL res -880 448 R0
SYMATTR InstName R28
SYMATTR Value 1.608k
SYMBOL res -752 448 R0
SYMATTR InstName R29
SYMATTR Value 7k
SYMBOL LT1366 432 1520 R90
SYMATTR InstName U10
SYMBOL LT1366 672 1648 R0
SYMATTR InstName U11
SYMBOL res 752 1600 R90
WINDOW 0 0 56 VBottom 2
WINDOW 3 32 56 VTop 2
SYMATTR InstName R30
SYMATTR Value 100k
SYMBOL LT1366 1072 1664 R0
SYMATTR InstName U12
SYMBOL res 960 1696 R90
WINDOW 0 0 56 VBottom 2
WINDOW 3 32 56 VTop 2
SYMATTR InstName R31
SYMATTR Value 100k
SYMBOL res 1152 1616 R90
WINDOW 0 0 56 VBottom 2
WINDOW 3 32 56 VTop 2
SYMATTR InstName R32
SYMATTR Value 200k
SYMBOL res 528 1680 R90
WINDOW 0 0 56 VBottom 2
WINDOW 3 32 56 VTop 2
SYMATTR InstName R33
SYMATTR Value 100k

The netlist it stands for:
* vcf_hopefully.asc
XU1 N002 N004 N007 N003 N005 N003 N008 N009 AD633  ; pins X1 X2 Y1 Y2 V- Z W V+
V1 N009 0 15
V2 N005 0 -15
C1 N009 0 0.1µ
C2 0 N005 0.1µ
R1 N008 N003 2k
C3 N003 0 1µ
XX1 N006 NC_01 lfo_new_square
XX3 N011 NC_02 NC_03 Key_Input_2VCOSFINAL  ; pins KEY1 KEY2 trigger_signal
XU2 0 N001 vcc vee N002 LT1366  ; pins In+ In- V+ V- OUT
V3 vcc 0 5
V4 vee 0 -5
R2 N001 N004 100k
R3 N002 N001 100k
XU3 N012 N010 vcc vee N010 LT1366  ; pins In+ In- V+ V- OUT
XX2 N011 0 NC_04 NC_05 NC_06 NC_07 N012 NC_08 vco_2keys
XU4 N006 N004 vcc vee N004 LT1366  ; pins In+ In- V+ V- OUT
V5 N007 0 SINE(0 3 440)

* block symbol definitions
.subckt lfo_new_square sine square
R1 square N008 2k
R2 N008 0 1k
C4 N002 N006 {x}
C5 N006 N005 {x}
C6 N005 N004 {x}
R8 0 N002 {y}
R9 0 N006 {y}
R10 0 N005 {y}
XU4 0 N002 vcc vee N001 LT1366  ; pins In+ In- V+ V- OUT
XU2 N008 sine N007 N009 square LT1366  ; pins In+ In- V+ V- OUT
R3 N001 N002 725k
XU1 0 N003 vcc vee sine LT1366  ; pins In+ In- V+ V- OUT
R5 N003 N001 1k
R6 N003 N010 1k
R7 sine N003 50k
R11 N009 vee 5k
R12 0 N009 30
R13 0 N007 30
R14 N007 vcc 5k
R4 N001 N004 {y}
R15 vcc N010 50k
R16 N010 0 70
.param x 1u
.param y 25k
* remember to change the node no. when you alter the circuit
.ends lfo_new_square

.subckt vco_2keys KEY1 KEY2 SQUARE SQUARE2 SUM-SQUARE SUM-TRIANGLE TRIANGLE TRIANGLE2
R34 vcc N009 1Meg
C5 N014 N009 1n
R35 N012 N014 1k
R36 N004 N003 30k
R37 N007 KEY 100k
R38 N008 N007 2k
C6 N006 N005 2.08n
R39 N010 N004 48k
R40 N010 0 48k
R41 N005 N015 48k
Q7 N015 N016 0 0 2N2222
R42 SQUARE N016 50k
R43 SQUARE N011 99k
R44 0 N011 50k
R45 N005 N004 100k
Q8 N009 N008 N012 0 2N2222
Q9 N003 0 N012 0 2N2222
XU15 0 N007 vcc vee N008 LT1366  ; pins In+ In- V+ V- OUT
XU16 0 N009 vcc vee N014 LT1366  ; pins In+ In- V+ V- OUT
XU17 0 N003 vcc vee N004 LT1366  ; pins In+ In- V+ V- OUT
XU18 N010 N005 vcc vee N006 LT1366  ; pins In+ In- V+ V- OUT
XU19 N011 N006 vcc vee SQUARE LT1366  ; pins In+ In- V+ V- OUT
XU27 N006 T1 vcc vee T1 LT1366  ; pins In+ In- V+ V- OUT
XU28 0 N001 vcc vee N002 LT1366  ; pins In+ In- V+ V- OUT
R64 N001 T1 1k
R65 N002 N001 2.5k
R66 TRIANGLE 0 100k
V3 vcc 0 5
V4 vee 0 -5
XX1 N013 NC_01 lfo_new_square
XX2 KEY NC_02 key_input_with_trigger
R1 N007 N013 100k
S1 N002 TRIANGLE KEY 0 M
R2 N013 0 5k
* VIN ^
* change KEY value depending on the key being simulated
* there is a table I will provide in my VCO explained document
* so bare with me
* 3.0833 523.25HZ
* 3.2500 587.33HZ
* 3.4167 659.256
* 3.5000 698.456Hz
* 3.6667 783.99Hz
* 3.8333 880Hz
* 4.0000 987.766Hz
.model M SW(Vt = 2)
.tran 20 uic
.options abstol = 1e-10
.options cshunt = 1e-15
.options reltol = 0.003
.ends vco_2keys

.subckt key_input_with_trigger the_key_that_is_pressed_xD trigger_signal
R1 N002 N009 1k
R3 N001 N008 1k
R4 N008 0 1.5k
R5 N004 N011 1k
R6 N011 0 1k
R7 N003 N010 1k
R9 N005 N012 1k
R11 N007 N014 1k
R13 N006 N013 1k
V§B4 N001 0 PWL(30.499999999999 0 30.5 5 35 5 35.000000000001 0)
V§A4 N002 0 PWL(25.499999999999 0 25.5 5 30 5 30.000000000001 0)
V§G4 N003 0 PWL(20.499999999999 0 20.5 5 25 5 25.000000000001 0)
V§F4 N004 0 PWL(15.499999999999 0 15.5 5 20 5 20.000000000001 0)
V§E4 N005 0 PWL(10.499999999999 0 10.5 5 15 5 15.000000000001 0)
V§D4 N006 0 PWL(5.499999999999 0 5.5 5 10 5 10.000000000001 0)
V§C4 N007 0 PWL(0 0 0.049999999999 0 0.05 5 5 5 5.000000000001 0)
XU1 0 N015 vc ve N016 LT1366  ; pins In+ In- V+ V- OUT
R15 N016 N015 100k
R16 N015 B4 100k
R17 N015 A4 100k
R18 N015 G4 100k
R19 N015 F4 100k
R20 N015 E4 100k
R21 N015 D4 100k
R22 N015 C4 100k
XU3 N010 G4 vc ve G4 LT1366  ; pins In+ In- V+ V- OUT
XU2 N008 B4 vc ve B4 LT1366  ; pins In+ In- V+ V- OUT
XU4 N009 A4 vc ve A4 LT1366  ; pins In+ In- V+ V- OUT
XU5 N012 E4 vc ve E4 LT1366  ; pins In+ In- V+ V- OUT
XU6 N011 F4 vc ve F4 LT1366  ; pins In+ In- V+ V- OUT
XU8 N014 C4 vc ve C4 LT1366  ; pins In+ In- V+ V- OUT
XU9 N013 D4 vc ve D4 LT1366  ; pins In+ In- V+ V- OUT
V1 vc 0 5
V2 ve 0 -5
XU7 0 N017 vc ve the_key_that_is_pressed_xD LT1366  ; pins In+ In- V+ V- OUT
R23 N017 N016 100k
R24 the_key_that_is_pressed_xD N017 100k
R12 N014 0 2.5k
R25 N014 0 1k
R2 N013 0 4.5k
R8 N013 0 1k
R10 N012 0 1.495k
R14 N012 0 2.5k
R26 N010 0 1.3k
R27 N010 0 9.5k
R28 N009 0 1.608k
R29 N009 0 7k
XU10 the_key_that_is_pressed_xD N018 vc ve N018 LT1366  ; pins In+ In- V+ V- OUT
XU11 0 N019 vc ve N020 LT1366  ; pins In+ In- V+ V- OUT
R30 N020 N019 100k
XU12 0 N021 vc ve trigger_signal LT1366  ; pins In+ In- V+ V- OUT
R31 N021 N020 100k
R32 trigger_signal N021 200k
R33 N019 N018 100k
.ends key_input_with_trigger

.model NPN NPN
.model PNP PNP
.lib standard.bjt
.tran 10 uic
.options abstol = 1e-10
.options cshunt = 1e-15
.options reltol = 0.003
.lib C:\Users\hp\Documents\GitHub\EEE-Summer-Project-2020\AD633_imported.log
.lib LTC.lib
.backanno
.end